# Altium schematic sheet Power.SchDoc
size A4; SheetNumber: 5; SheetTotal: 9
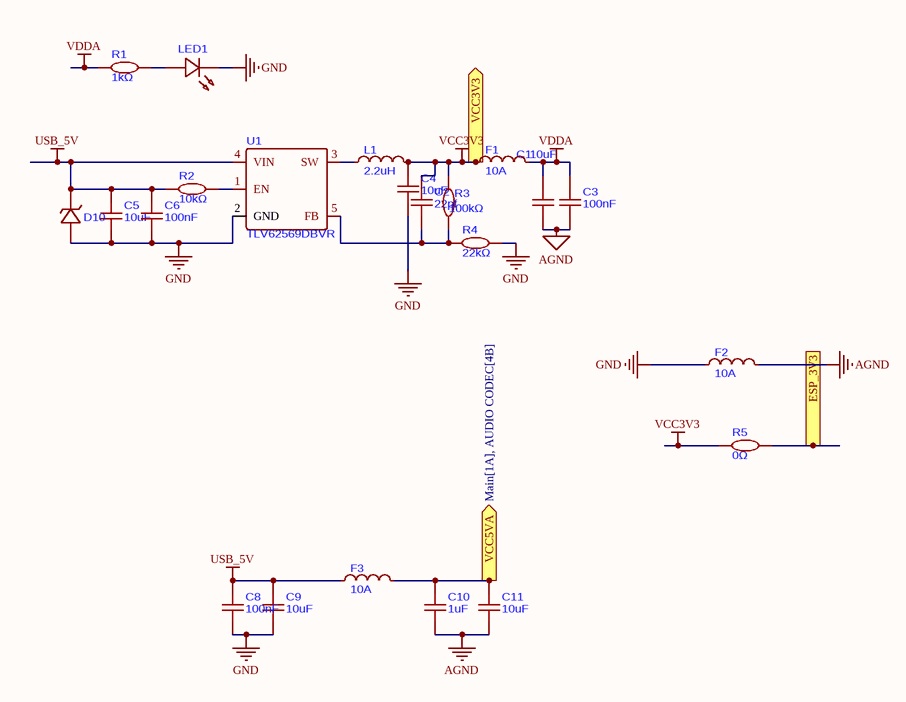
[diagram p0: Power.SchDoc]

## Parts
C1  10uF  [C0603]
C2  22pf  [C0603]
C3  100nF  [C0603]
C4  10uF  [C0603]
C5  10uF  [C0603]
C6  100nF  [C0603]
C8  100nF  [C0603]
C9  10uF  [C0603]
C10  1uF  [C0603]
C11  10uF  [C0603]
D10  DIODE ZENER 5.6V 500mW LL-34  [LL-34_L3.5-W1.5-RD]  (value not drawn)
F1  10A  [IND-SMD_L8.5-W3.1]
F2  10A  [IND-SMD_L8.5-W3.1]
F3  10A  [IND-SMD_L8.5-W3.1]
L1  2.2uH  [IND-SMD_L5.4-W5.2]
LED1  XL-1608SURC-06  [LED0603-RD_RED]  (value not drawn)
R1  1kΩ  [R0603]
R2  10kΩ  [R0603]
R3  100kΩ  [R0603]
R4  22kΩ  [R0603]
R5  0Ω  [R0603]
U1  TLV62569DBVR  [SOT-23-5_L3.0-W1.7-P0.95-LS2.8-BR]

## Ports
ESP_3V3 (out, see Main[2A], DSI&CSI CONNECTOR[3C], ETH-PHY[2A], interfaceUART&I2C[1C], SOM[6B]), VCC3V3 (out, see Main[2A], SOM[4A], USB[4C]), VCC5VA (out, see Main[1A], AUDIO CODEC[4B])

## Nets
AGND: C1.1 C3.1 C10.2 C11.1 F2.2
GND: C4.1 C5.1 C6.1 C8.1 C9.1 D10.2(A) F2.1 LED1.1(K) R4.2 U1.2(GND)
USB_5V: C5.2 C6.2 C8.2 C9.2 D10.1(K) F3.1 R2.1 U1.4(VIN)
VCC3V3: C2.2 C4.2 F1.1 L1.2 R3.2 R5.1 ; port VCC3V3
VDDA: C1.2 C3.2 F1.2 R1.2
ESP_3V3: R5.2 ; port ESP_3V3
VCC5VA: C10.1 C11.2 F3.2 ; port VCC5VA
NetC2_1: C2.1 R3.1 R4.1 U1.5(FB)
NetL1_1: L1.1 U1.3(SW)
NetLED1_2: LED1.2(A) R1.1
NetR2_2: R2.2 U1.1(EN)

## Library data of the parts
C1 C4 C5 C9 C11 = CL10A106MA8NRNC: 25V 10uF X5R ±20% 0603 Ceramic Capacitors ROHS
C2 = CL10C220JB8NNNC: 50V 22pF C0G ±5% 0603 Ceramic Capacitors RoHS
C3 C6 C8 = CC0603KRX7R9BB104: 50V 100nF X7R ±10% 0603 Ceramic Capacitors ROHS
C10 = CL10B105KA8NNNC: 25V 1uF X7R ±10% 0603 Ceramic Capacitors ROHS
D10 = ZMM5V6_C707195: Zener Diode Independent 5.6V 500mW Surface Mount LL-34
F1-F3 = HI3312X101R-10: 4mΩ 100Ω@100MHz SMD,8.5x3.1mm Ferrite Beads and Chips ROHS
L1 = APH0530T2R2M: 7A 2.2uH Molded Inductor ±20% 7A 29mΩ SMD,5.4x5.2mm Fixed Inductors RoHS
LED1 = XL-1608SURC-06: 20mA 2.3V Red 50mW 0603 LED Indication - Discrete ROHS
R1 = RMC 0603 1K J N: 100mW 1kΩ 50V ±100ppm/℃ Thick Film Resistor ±5% 0603 Chip Resistor - Surface Mount ROHS
R2 = RC0603FR-0710KL: 100mW 10kΩ 75V ±100ppm/℃ Thick Film Resistor ±1% 0603 Chip Resistor - Surface Mount ROHS
R3 = RC0603FR-07100KL: 100mW 100kΩ 75V ±100ppm/℃ Thick Film Resistor ±1% 0603 Chip Resistor - Surface Mount ROHS
R4 = RC0603FR-0722KL: 100mW 22kΩ 75V ±100ppm/℃ Thick Film Resistor ±1% 0603 Chip Resistor - Surface Mount RoHS
R5 = RC0603JR-070RL: 100mW 0Ω 75V Thick Film Resistor ±5% 0603 Chip Resistor - Surface Mount RoHS
U1 = TLV62569DBVR: 1.5MHz 2A Buck Adjustable 600mV~5.5V 1 SOT-23-5 Voltage Regulators - DC DC Switching Regulators RoHS